# EAGLE design connector_board_final_schematic (EAGLE 9.5.0)
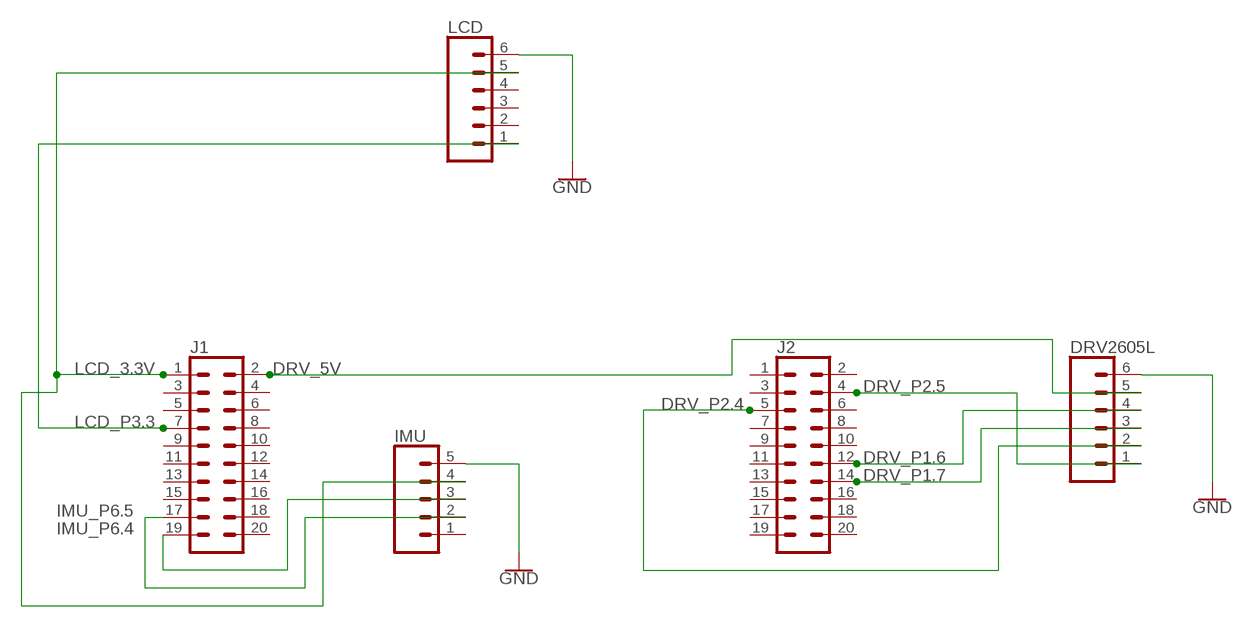
[diagram p0: schematic, sheet 1]

## Parts
DRV2605L  CONN_06SILK_FEMALE_PTH  [1X06]
IMU  CONN_05  [1X05]
J1  CONN_10X2  [2X10]
J2  CONN_10X2  [2X10]
LCD  CONN_06SILK_FEMALE_PTH  [1X06]

## Nets
DRV_5V: DRV2605L.5 J1.2
DRV_P1.6: DRV2605L.4 J2.12
DRV_P1.7: DRV2605L.3 J2.14
DRV_P2.4: DRV2605L.2 J2.5
DRV_P2.5: DRV2605L.1 J2.4
GND: DRV2605L.6 IMU.5 LCD.6
IMU_P6.4: IMU.3 J1.19
IMU_P6.5: IMU.2 J1.17
LCD_3.3V: IMU.4 J1.1 LCD.5
LCD_P3.3: J1.7 LCD.1
Unconnected: IMU.1 J1.3 J1.4 J1.5 J1.6 J1.8 J1.9 J1.10 J1.11 J1.12 J1.13 J1.14 J1.15 J1.16 J1.18 J1.20 J2.1 J2.2 J2.3 J2.6 J2.7 J2.8 J2.9 J2.10 J2.11 J2.13 J2.15 J2.16 J2.17 J2.18 J2.19 J2.20 LCD.2 LCD.3 LCD.4

## Library data of the parts
DRV2605L LCD = SparkFun-Connectors:CONN_06: Multi connection point. Often used as Generic Header-pin footprint for 0.1 inch spaced/style header connections On any of the 0.1 inch spaced packages, you can populate with these: Break Away Headers - Straight <https://www.sparkfun.com/products/116> (PRT-00116) Break Away Male Headers - Right Angle <https://www.sparkfun.com/products/553> (PRT-00553) Female Headers <https://www.sparkfun.com/products/115> (PRT-00115) Break Away Headers - Machine Pin <https://www.sparkfun.com/products/117> (PRT-00117) Break Away Female Headers - Swiss Machine Pin <https://www.sparkfun.com/products/743> (PRT-00743) Arduino Stackable Header - 6 Pin <https://www.sparkfun.com/products/9280> (PRT-09280) For SCREWTERMINALS and SPRING TERMINALS visit here: Screw Terimnals on SparkFun.com <https://www.sparkfun.com/search/results?term=Screw+Terminals> (5mm/3.5mm/2.54mm spacing) This device is also useful as a general connection point to wire up your design to another part of your project. Our various solder wires solder well into these plated through hole pads. Hook-Up Wire - Assortment (Stranded, 22 AWG) <https://www.sparkfun.com/products/11375> (PRT-11375) Hook-Up Wire - Assortment (Solid Core, 22 AWG) <https://www.sparkfun.com/products/11367> (PRT-11367) View the entire wire category on our website here <https://www.sparkfun.com/categories/141>; PROD_ID: CONN-08437
IMU = SparkFun-Connectors:CONN_05: Multi connection point. Often used as Generic Header-pin footprint for 0.1 inch spaced/style header connections On any of the 0.1 inch spaced packages, you can populate with these: Break Away Headers - Straight <https://www.sparkfun.com/products/116> (PRT-00116) Break Away Male Headers - Right Angle <https://www.sparkfun.com/products/553> (PRT-00553) Female Headers <https://www.sparkfun.com/products/115> (PRT-00115) Break Away Headers - Machine Pin <https://www.sparkfun.com/products/117> (PRT-00117) Break Away Female Headers - Swiss Machine Pin <https://www.sparkfun.com/products/743> (PRT-00743) For SCREWTERMINALS and SPRING TERMINALS visit here: Screw Terimnals on SparkFun.com <https://www.sparkfun.com/search/results?term=Screw+Terminals> (5mm/3.5mm/2.54mm spacing) This device is also useful as a general connection point to wire up your design to another part of your project. Our various solder wires solder well into these plated through hole pads. Hook-Up Wire - Assortment (Stranded, 22 AWG) <https://www.sparkfun.com/products/11375> (PRT-11375) Hook-Up Wire - Assortment (Solid Core, 22 AWG) <https://www.sparkfun.com/products/11367> (PRT-11367) View the entire wire category on our website here <https://www.sparkfun.com/categories/141> Special notes: Molex polarized connector foot print use with SKU : PRT-08231 with associated crimp pins and housings. 1MM SMD Version SKU: PRT-10208
J1 J2 = SparkFun-Connectors:CONN_10X2: Multi connection point. Often used as Generic Header-pin footprint for 0.1 inch spaced/style header connections On any of the 0.1 inch spaced packages, you can populate with these: Break Away Headers - Straight <https://www.sparkfun.com/products/116> (PRT-00116) Break Away Male Headers - Right Angle <https://www.sparkfun.com/products/553> (PRT-00553) Female Headers <https://www.sparkfun.com/products/115> (PRT-00115) Break Away Headers - Machine Pin <https://www.sparkfun.com/products/117> (PRT-00117) Break Away Female Headers - Swiss Machine Pin <https://www.sparkfun.com/products/743> (PRT-00743) Special note about the "SPECIAL" package: This was SPECIALLY designed to be used with our Graphic LCD Backpack. Be sure you want to use this! It is not only staggered on each line of header holes, but IT IS ALSO offset of the center point of the top and bottom lines by 5 mil. This causes the headers to lock into place on the "standard" footprint on the LCD screen. The extra squares on the tdocu layer are there simply to reference other pins (if you were to actually populate a longer header than ten long - this is what we do with the backpacks).

## Board
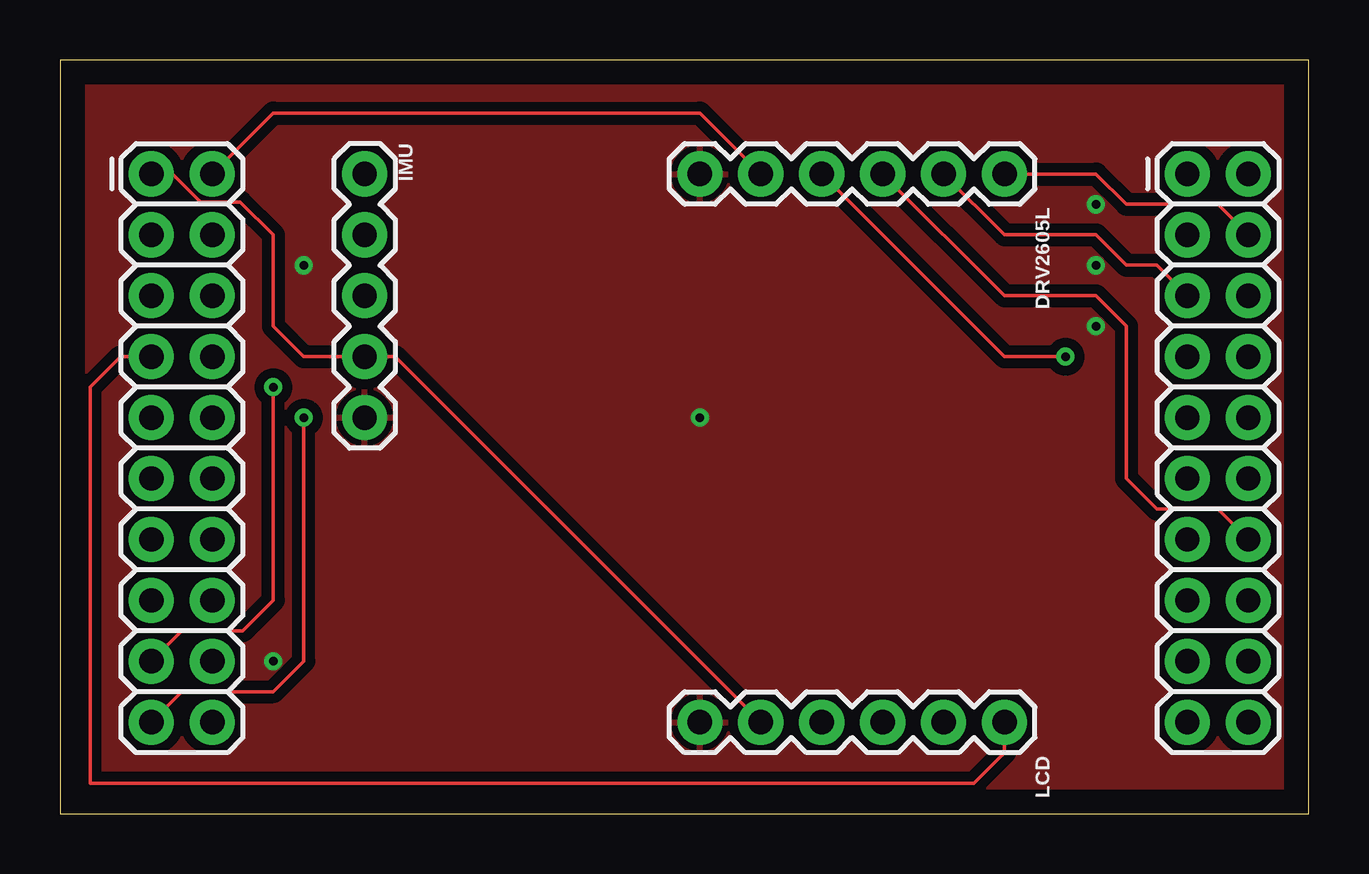
[diagram p1: board, top side]
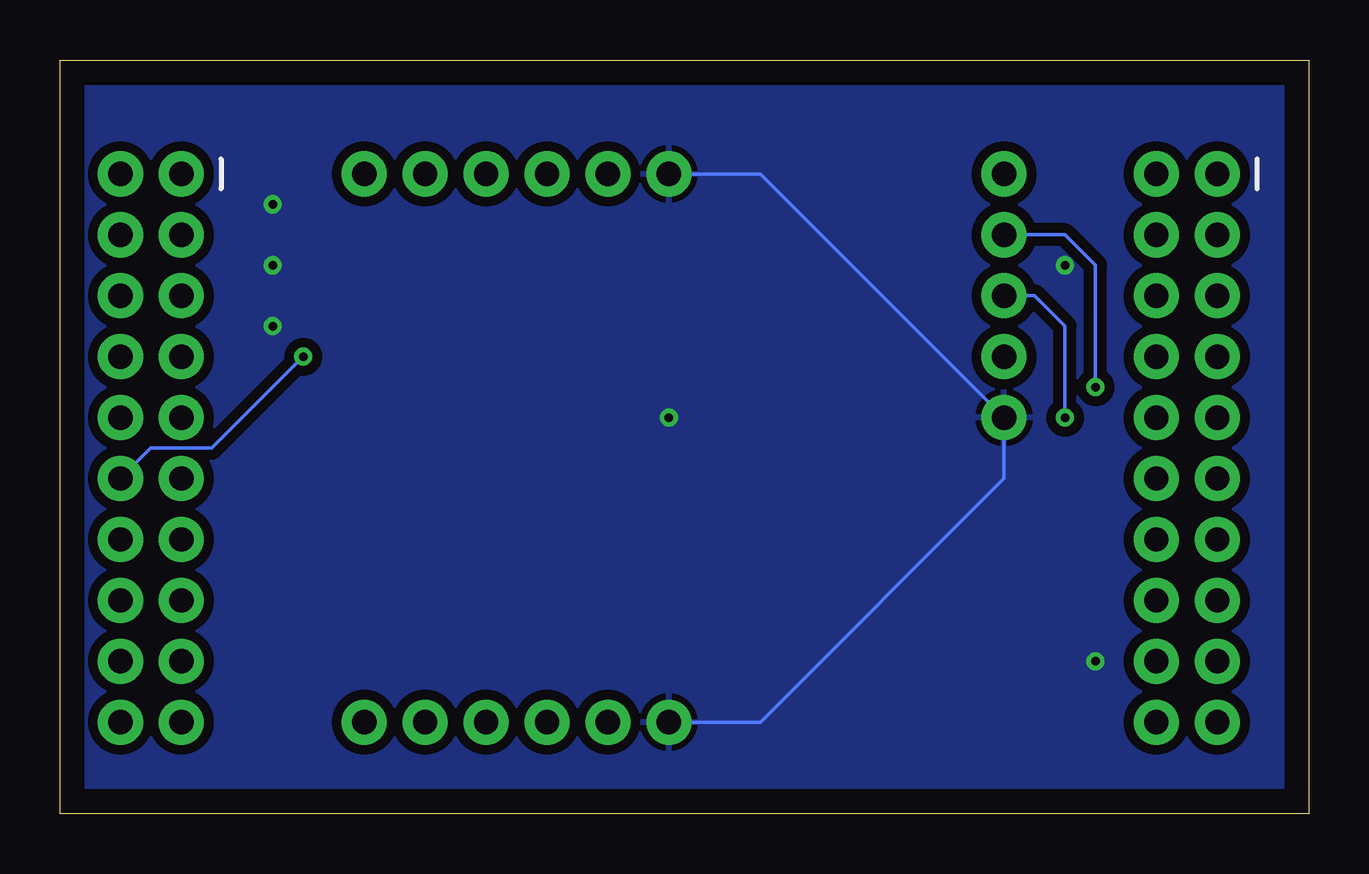
[diagram p2: board, bottom side, seen from below]

Size 52.05 x 31.42 mm. Coordinates in mm from the lower left corner, seen from the top.
Outline: 0,0 52.05,0 52.05,31.42 0,31.42 0,0
Copper layers (1*16): Top 0.035mm / dielectric 1.5mm / Bottom 0.035mm
Design rules "default": minimum track width 6mil, minimum drill 0.35mm, track to track 6mil, track to pad 6mil, pad to pad 6mil, via to via 6mil, smd to smd 6mil, copper to edge 40mil, drill to drill 6mil, minimum pad ring 10mil, minimum via ring 8mil, stop-mask expansion 4mil, vias tented up to drill 0mil, thermal gap 10mil

### Footprints (pad centres in the part's own frame; a part is rotated, then mirrored left to right if it is on the bottom)
1X06 = drill 1.016 pad 1.88: 1 0,0; 2 2.54,0; 3 5.08,0; 4 7.62,0; 5 10.16,0; 6 12.7,0
1X05 = drill 1.016 pad 1.88: 1 0,0; 2 2.54,0; 3 5.08,0; 4 7.62,0; 5 10.16,0
2X10 = drill 1.016 pad 1.88: 1 0,0; 2 0,2.54; 3 2.54,0; 4 2.54,2.54; 5 5.08,0; 6 5.08,2.54; 7 7.62,0; 8 7.62,2.54; 9 10.16,0; 10 10.16,2.54; 11 12.7,0; 12 12.7,2.54; 13 15.24,0; 14 15.24,2.54; 15 17.78,0; 16 17.78,2.54; 17 20.32,0; 18 20.32,2.54; 19 22.86,0; 20 22.86,2.54

### Placement (x,y rotation side)
DRV2605L  39.37,26.67 180 top
IMU  12.7,26.67 270 top
J1  3.81,26.67 270 top
J2  46.99,26.67 270 top
LCD  39.37,3.81 180 top

### Tracks (layer width: path | path; a pad name or v marks a point on that pad's centre or on a via)
DRV_5V
  Top 0.152: J1.2 8.89,29.21 26.67,29.21 DRV2605L.5
DRV_P1.6  (via drill 0.35)
  Top 0.152: DRV2605L.4 39.37,19.05 v41.91,19.05
  Bottom 0.152: v41.91,19.05 45.72,15.24 48.26,15.24 J2.12
DRV_P1.7
  Top 0.152: DRV2605L.3 39.37,21.59 43.18,21.59 44.45,20.32 44.45,13.97 45.72,12.7 48.26,12.7 J2.14
DRV_P2.4
  Top 0.152: DRV2605L.2 39.37,24.13 43.18,24.13 44.45,22.86 45.72,22.86 J2.5
DRV_P2.5
  Top 0.152: DRV2605L.1 43.18,26.67 44.45,25.4 48.26,25.4 J2.4
GND  (via drill 0.35)
  Bottom 0.152: DRV2605L.6 22.86,26.67 IMU.5 12.7,13.97 22.86,3.81 LCD.6
  other vias: 8.89,6.35 26.67,16.51 43.18,25.4 43.18,22.86 43.18,20.32 10.16,22.86
  pour Top (isolate 0.406): 0,0 0,30.48 52.07,30.48 52.07,0
  pour Bottom (isolate 0.406): 0,0 0,30.48 52.07,30.48 52.07,0
IMU_P6.4  (via drill 0.35)
  Top 0.152: J1.19 5.08,5.08 8.89,5.08 10.16,6.35 v10.16,16.51
  Bottom 0.152: v10.16,16.51 10.16,20.32 11.43,21.59 IMU.3
IMU_P6.5  (via drill 0.35)
  Top 0.152: J1.17 5.08,7.62 7.62,7.62 8.89,8.89 v8.89,17.78
  Bottom 0.152: IMU.2 10.16,24.13 8.89,22.86 v8.89,17.78
LCD_3.3V
  Top 0.152: LCD.5 13.97,19.05 IMU.4 10.16,19.05 8.89,20.32 8.89,24.13 7.52,25.5 5.87,25.5 4.7,26.67 J1.1
LCD_P3.3
  Top 0.152: LCD.1 39.37,2.54 38.1,1.27 1.27,1.27 1.27,17.78 2.54,19.05 J1.7